# Altium schematic sheet DAC.SchDoc
size B; SheetNumber: 14; SheetTotal: 19
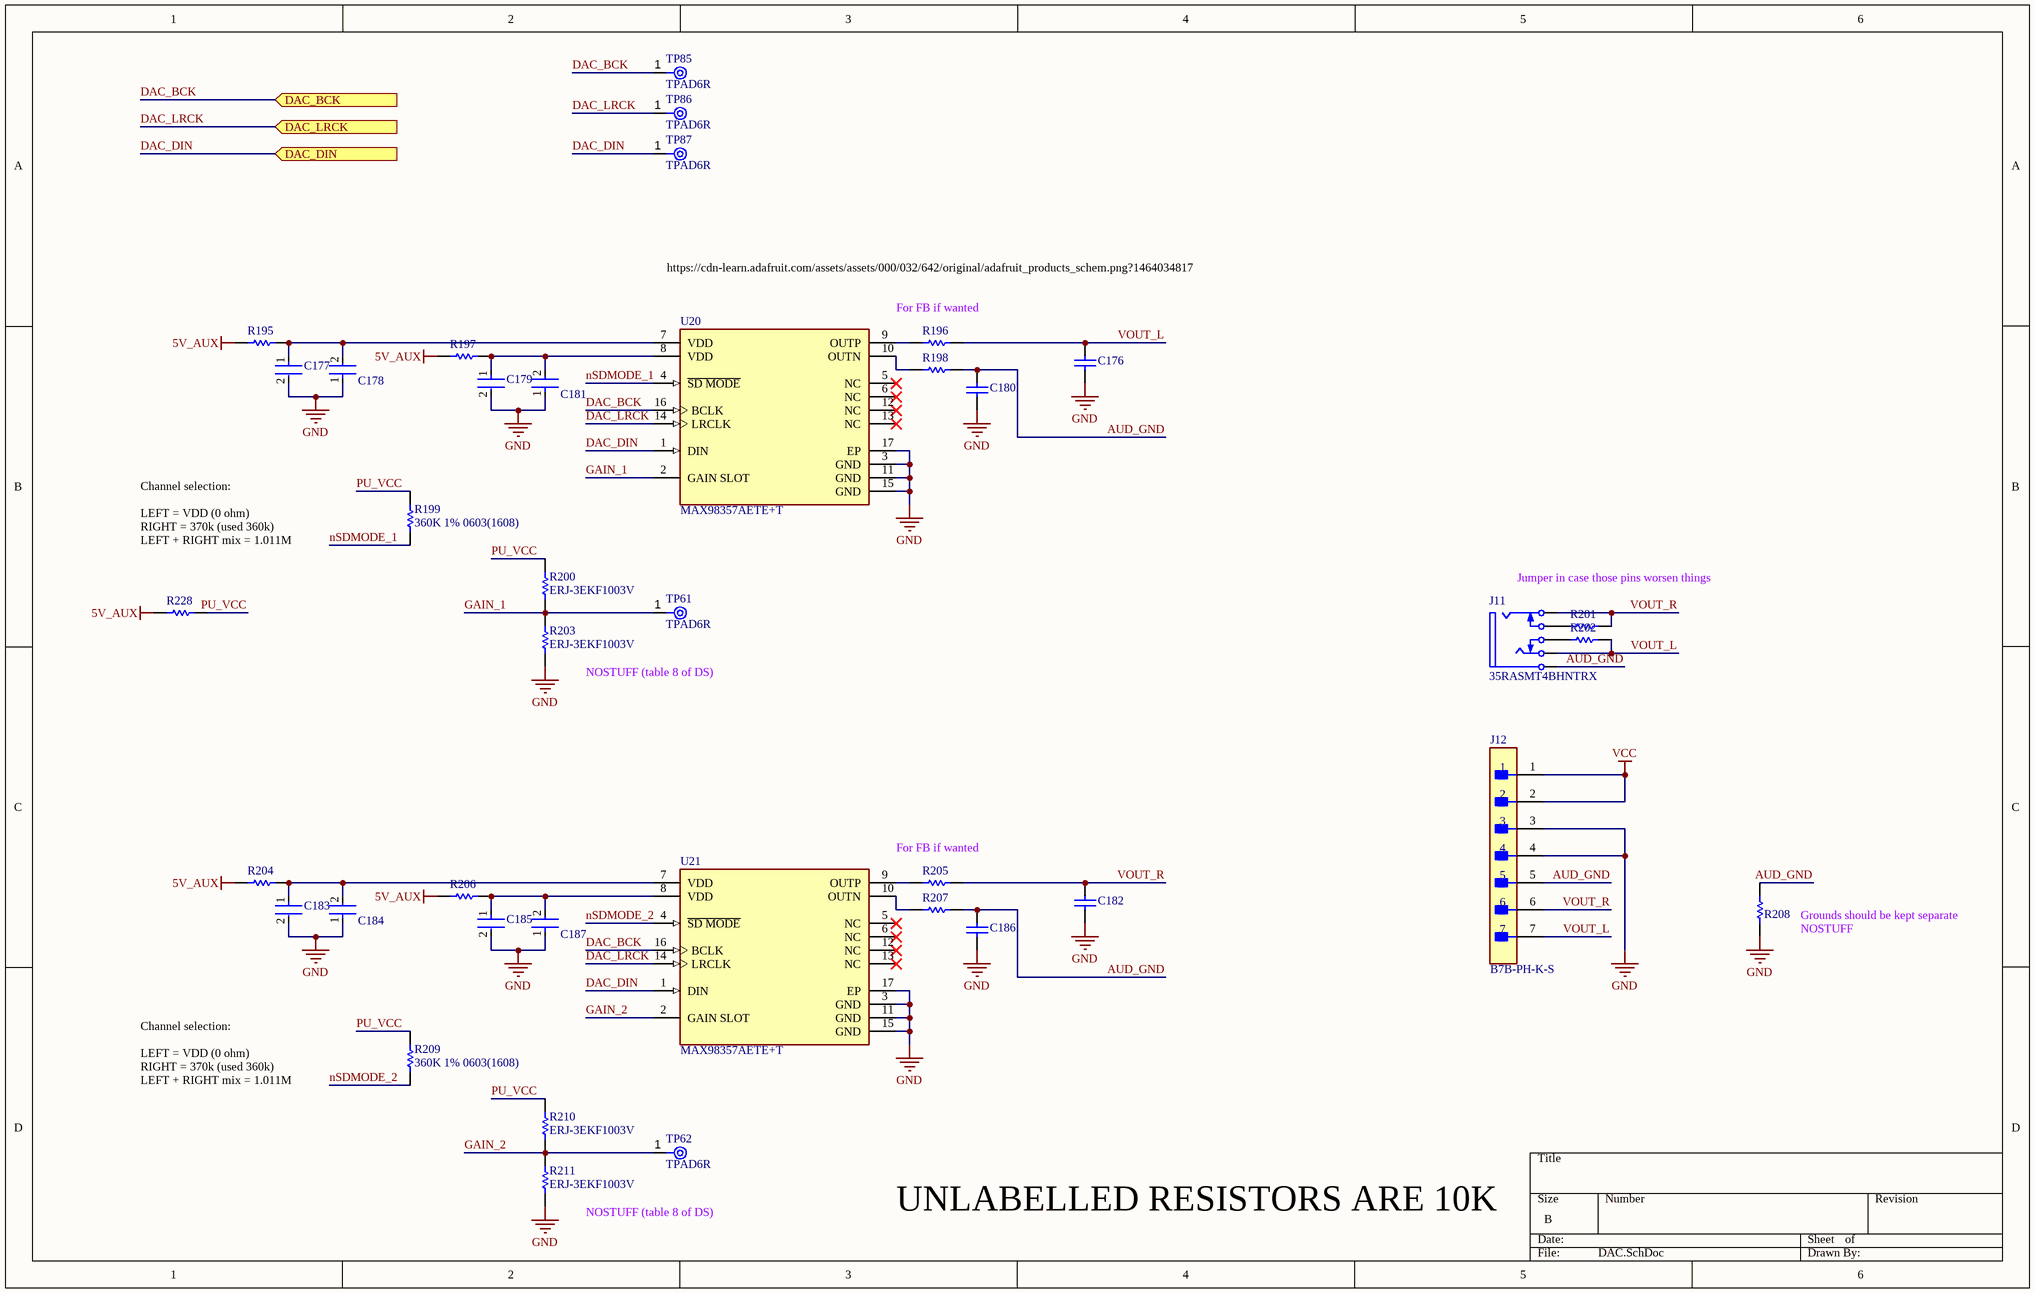
[diagram p0: DAC.SchDoc]

## Parts
C176  C0805C221K5RACTU  [CAPC2013X88X50ML20T25]  (value not drawn)
C177  CL05A106MP5NUNC  [FP-CL05A106MP5NUNC-MFG]  (value not drawn)
C178  C1005X7R1H104K050BB  [FP-C1005-050-0_05-IPC_C]  (value not drawn)
C179  CL05A106MP5NUNC  [FP-CL05A106MP5NUNC-MFG]  (value not drawn)
C180  C0805C221K5RACTU  [CAPC2013X88X50ML20T25]  (value not drawn)
C181  C1005X7R1H104K050BB  [FP-C1005-050-0_05-IPC_C]  (value not drawn)
C182  C0805C221K5RACTU  [CAPC2013X88X50ML20T25]  (value not drawn)
C183  CL05A106MP5NUNC  [FP-CL05A106MP5NUNC-MFG]  (value not drawn)
C184  C1005X7R1H104K050BB  [FP-C1005-050-0_05-IPC_C]  (value not drawn)
C185  CL05A106MP5NUNC  [FP-CL05A106MP5NUNC-MFG]  (value not drawn)
C186  C0805C221K5RACTU  [CAPC2013X88X50ML20T25]  (value not drawn)
C187  C1005X7R1H104K050BB  [FP-C1005-050-0_05-IPC_C]  (value not drawn)
J11  35RASMT4BHNTRX  [SWIT-35RASMT4BHNTRX_V]
J12  B7B-PH-K-S  [FP-B7B-PH-K-S-MFG]
R195  RC0402JR-070RL  [RESC1005X40X25NL05T10]  (value not drawn)
R196  RC0603JR-070RL  [RESC1608X55X25ML10T15]  (value not drawn)
R197  RC0402JR-070RL  [RESC1005X40X25NL05T10]  (value not drawn)
R198  RC0603JR-070RL  [RESC1608X55X25ML10T15]  (value not drawn)
R199  360K 1% 0603(1608)  [RESC0603(1608)_M]
R200  ERJ-3EKF1003V  [RESC1608X55X30ML15T15]
R201  RC0402JR-070RL  [RESC1005X40X25NL05T10]  (value not drawn)
R202  RC0402JR-070RL  [RESC1005X40X25NL05T10]  (value not drawn)
R203  ERJ-3EKF1003V  [RESC1608X55X30ML15T15]
R204  RC0402JR-070RL  [RESC1005X40X25NL05T10]  (value not drawn)
R205  RC0603JR-070RL  [RESC1608X55X25ML10T15]  (value not drawn)
R206  RC0402JR-070RL  [RESC1005X40X25NL05T10]  (value not drawn)
R207  RC0603JR-070RL  [RESC1608X55X25ML10T15]  (value not drawn)
R208  RC0603JR-070RL  [RESC1608X55X25ML10T15]  (value not drawn)
R209  360K 1% 0603(1608)  [RESC0603(1608)_M]
R210  ERJ-3EKF1003V  [RESC1608X55X30ML15T15]
R211  ERJ-3EKF1003V  [RESC1608X55X30ML15T15]
R228  RC0402JR-070RL  [RESC1005X40X25NL05T10]  (value not drawn)
TP61  TPAD6R  [New footprint 1]
TP62  TPAD6R  [New footprint 1]
TP85  TPAD6R  [New footprint 1]
TP86  TPAD6R  [New footprint 1]
TP87  TPAD6R  [New footprint 1]
U20  MAX98357AETE+T  [FP-T1633-4-MFG]
U21  MAX98357AETE+T  [FP-T1633-4-MFG]

## Ports
DAC_BCK (in, see VISION_BETA_EBB[4C]), DAC_DIN (in, see VISION_BETA_EBB[4C]), DAC_LRCK (in, see VISION_BETA_EBB[4C])

## Nets
5V_AUX: R195.1 R197.1 R204.1 R206.1 R228.1
GND: C176.1 C177.2 C178.1 C179.2 C180.1 C181.1 C182.1 C183.2 C184.1 C185.2 C186.1 C187.1 J12.3 J12.4 R203.1 R208.2 R211.1 U20.3(GND) U20.11(GND) U20.15(GND) U20.17(EP) U21.3(GND) U21.11(GND) U21.15(GND) U21.17(EP)
VCC: J12.1 J12.2
AUD_GND: C180.2 C186.2 J11.1 J12.5 R198.2 R207.2 R208.1
DAC_BCK: TP85.1(TP) U20.16(BCLK) U21.16(BCLK) ; port DAC_BCK
DAC_DIN: TP87.1(TP) U20.1(DIN) U21.1(DIN) ; port DAC_DIN
DAC_LRCK: TP86.1(TP) U20.14(LRCLK) U21.14(LRCLK) ; port DAC_LRCK
GAIN_1: R200.1 R203.2 TP61.1(TP) U20.2(GAIN_SLOT)
GAIN_2: R210.1 R211.2 TP62.1(TP) U21.2(GAIN_SLOT)
nSDMODE_1: R199.1 U20.4(~{SD_MODE})
nSDMODE_2: R209.1 U21.4(~{SD_MODE})
PU_VCC: R199.2 R200.2 R209.2 R210.2 R228.2
VOUT_L: C176.2 J11.3 J12.7 R196.2 R202.2
VOUT_R: C182.2 J11.2 J12.6 R201.2 R205.2
NetC177_1: C177.1 C178.2 R195.2 U20.7(VDD)
NetC179_1: C179.1 C181.2 R197.2 U20.8(VDD)
NetC183_1: C183.1 C184.2 R204.2 U21.7(VDD)
NetC185_1: C185.1 C187.2 R206.2 U21.8(VDD)
NetJ11_4: J11.4 R201.1
NetJ11_5: J11.5 R202.1
NetR196_1: R196.1 U20.9(OUTP)
NetR198_1: R198.1 U20.10(OUTN)
NetR205_1: R205.1 U21.9(OUTP)
NetR207_1: R207.1 U21.10(OUTN)

Not connected (* = marked no-connect by the designer): U20 5(NC)* 6(NC)* 12(NC)* 13(NC)*; U21 5(NC)* 6(NC)* 12(NC)* 13(NC)*

## Notes on the sheet
- https://cdn-learn.adafruit.com/assets/assets/000/032/642/original/adafruit_products_schem.png?1464034817
- For FB if wanted
- Channel selection:
  LEFT = VDD (0 ohm)
  RIGHT = 370k (used 360k)
  LEFT + RIGHT mix = 1.011M
- Jumper in case those pins worsen things
- NOSTUFF (table 8 of DS)
- (near R208) Grounds should be kept separate
- (near R208) NOSTUFF
- UNLABELLED RESISTORS ARE 10K

## Library data of the parts
C176 C180 C182 C186 = CMP-2007-00321-1: Manufacturer: Kemet; Part Number: C0805C221K5RACTU
C177 C179 C183 C185 = CMP-13271-000002-1: CAP CER 10UF 10V X5R 0402; Manufacturer: Samsung; Temperature Coefficient: 15%; Tolerance: 20%; Material: Ceramic; Octopart: https://octopart.com/cl05a106mp5nunc-samsung-22457395; Voltage Rating: 10V; RoHS: TRUE; Value: 10uF; Height: 0.7mm; Digikey Description: CAP CER 10UF 10V X5R 0402; Automotive: No; Package: CL05A106MP5NUNC; Device Class L1: Passive Components; Capacitance: 10uF; Temperature Range High: +85°C; ComponentLink2Description: Datasheet; Device Class L2: Capacitors; Temperature Characteristic: X5R; Manufacturer Part Number: CL05A106MP5NUNC; Temperature: -55°C to +85°C; ComponentLink2URL: http://www.samsungsem.com/kr/support/product-search/mlcc/__icsFiles/afieldfile/2019/05/10/19-CL05A106MP5NUNC.pdf; Device Class L3: Ceramic Capacitors; Category: Cap; Temperature Range Low: -55°C; Ipc Land Pattern Name: CAPC10050X50; Lead Free: Yes
C178 C181 C184 C187 = CMP-2000-05393-2: Multilayer Ceramic Capacitors 100nF ±10% 50V X7R SMD 0402; Voltage: 50V; Dielectric Material: Ceramic; Min Operating Temperature: -55°C; Depth: 0.5mm; Radiation Hardening: No; RoHS Compliant: Yes; Voltage Rating (DC): 50V; Lead Free: Lead Free; Resistor Type: Ceramic; Height: 0.5mm; Dielectric: X7R; Thickness: 0.022inch; Case/Package: 0402; Case Code (Metric): 1005; Termination: SMD/SMT; Capacitance: 100nF; Packaging: Tape and Reel; Max Operating Temperature: 125°C; Mount: Surface Mount; Package Quantity: 1; Width: 0.02inch; Weight: 2.3E-05oz; Voltage Rating: 50V; Tolerance: 10%; Construction: Flat; Case Code (Imperial): 0402; Length: 1mm; REACH SVHC: No SVHC; Series: C
J11 = CMP-1772-00001-1: Female 3.5 mm Phone Jack, 5 Position, Height 5 mm, RoHS, Tape and Reel; Current Rating: 50 mA; Voltage Rating (DC): 12 V; ComponentLink1URL: http://www.switchcraft.com/; ComponentLink2Description: Datasheet; ComponentLink2URL: http://www.switchcraft.com/Drawings/35rasmt4bhntrx_cd.pdf; PackageDescription: Female 3.5 mm Phone Jack, 5 Position, Height 5 mm; PackageReference: 35RASMT4BHNTRX; Mount: Through Hole; DatasheetVersion: Rev. C, 07/2014; Contact Material: Silver; ComponentLink1Description: Manufacturer URL; Packaging: Tape and Reel; RoHSCompliant: true; Contact Plating: Silver; Package Quantity: 3000
J12 = CMP-17439-000359-1: CONN HEADER VERT 7POS 2MM; Contact Resistance: 10mR; Current Rating: 2A; Pitch: 0.079inch; Test Voltage: 800V; Gender: Male; Insulation Resistance: 1GR; Connector Type: Male Pin; Number of Contacts: 7; Contact Mating Length: 0.13inch; Color: Natural; Contact Material: Bronze; Contact Plating: Tin; Series: PH; Housing Color: Natural; Fastening Type: Detent; Orientation: Vertical; Mount: Through Hole; Housing Material: Nylon; Contact Type: Male Pin; Packaging: Bulk; Lead Free: Contains Lead; Number of Rows: 1; Package Quantity: 500; Termination: Press-Fit; Number of Positions: 7
R195 R197 R201 R202 R204 R206 R228 = CMP-1011-00001-2: Manufacturer: Yageo / Phycomp; Part Number: RC0402JR-070RL
R196 R198 R205 R207 R208 = CMP-2100-03667-1: Chip Resistor, 0 Ohm, +/- 5%, 0.1 W, -55 to 155 degC, 0603 (1608 Metric), RoHS, Tape and Reel; Manufacturer: Yageo; Temperature Coefficient: 200ppm/degreesC; Voltage Rating: 50V; Power Rating: 100mW; Resistance: 0mOhm; Width: 0.8mm; Max Operating Temperature: 155degC; Tolerance: 5%; Package Reference: 0603; Height: 0.45mm; Depth: 0.8mm; Package Description: 2-Pin Surface Mount Device, Body 1.6 x 0.8 mm; Termination: SMD/SMT; Package Quantity: 5000; Case/Package: 0603; Case Code (Imperial): 0603; Radiation Hardening: No; Number of Pins: 2; Length: 1.6mm; Lead Free: LeadFree; Voltage Rating (DC): 50V; Military Standard: Not; Datasheet URL: http://www.yageo.com/NewPortal/yageodocoutput?fileName=/pdf/R-Chip/PYu-RC_Group_51_RoHS_L_5.pdf; Manufacturer URL: http://www.yageo.com/; Packaging: TapeandReel; Case Code (Metric): 1608; Min Operating Temperature: -55degC; Composition: ThickFilm; RoHSCompliant: true; Contact Plating: Tin; Datasheet Version: Rev. 5, 10/2016; REACH SVHC: NoSVHC
R199 R209 = CMP-1012-00798-1: 360K 0.1W 1% 0603 (1608 Metric)  SMD; Case-Metric: 1608; Case-EIA: 0603; Value: 360000.00 Ohm; Power: 0.1 W; Tolerance: 1 %; Technology: SMT
R200 R203 R210 R211 = CMP-2000-00182-1: Manufacturer: Panasonic; Part Number: ERJ-3EKF1003V
TP61 TP62 TP85-TP87 = CMP-00025-2: Test Point .6mm
U20 U21 = CMP-05698-000018-1: IC AMP CLASS D MONO 3.2W 16TQFN; Max Supply Voltage: 5.5V; Max Output Current: 1.6A; Voltage Gain: 15dB; Max Power Dissipation: 1.666W; Min Supply Voltage: 2.5V; Power Supply Rejection Ratio (PSRR): 77dB; Series: -; Contact Plating: Tin; Min Operating Temperature: -40°C; Packaging: Tape and Reel; Max Output Power: 3.2W; Mount: Surface Mount; Number of Pins: 16; RoHS Compliant: Yes; Max Operating Temperature: 85°C; Radiation Hardening: No